# EAGLE schematic CDCEmu_Logic (EAGLE 9.6.1)
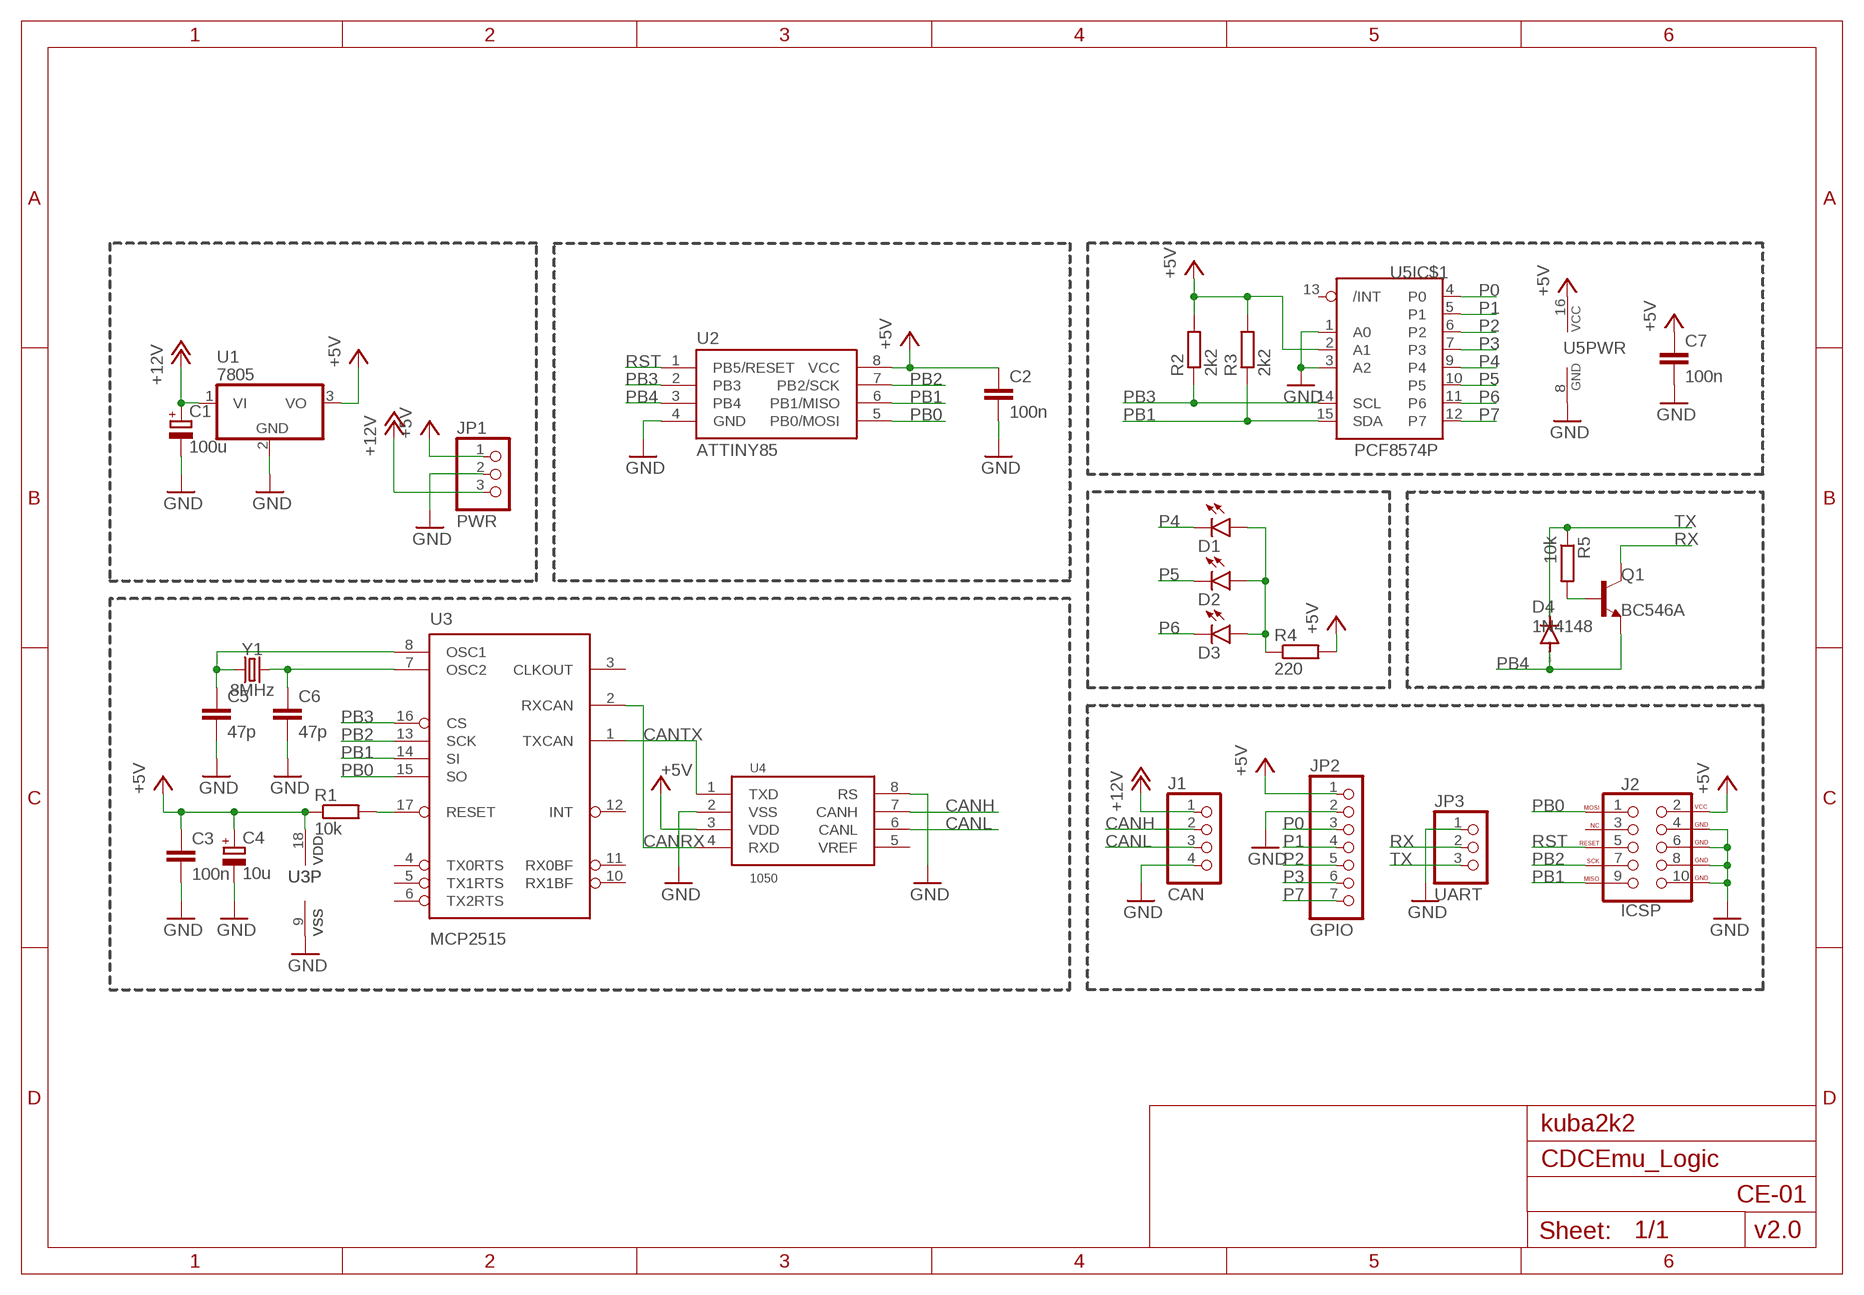
[diagram p0: schematic, sheet 1]

## Parts
C1  100u  CPOL-EUE2.5-6  [E2,5-6]
C2  100n  C-EU050-024X044  [C050-024X044]
C3  100n  C-EU050-024X044  [C050-024X044]
C4  10u  CPOL-EUE1.8-4  [E1,8-4]
C5  47p  C-EU025-024X044  [C025-024X044]
C6  47p  C-EU025-024X044  [C025-024X044]
C7  100n  C-EU050-024X044  [C050-024X044]
D1  LED3MM  [LED3MM]
D2  LED3MM  [LED3MM]
D3  LED3MM  [LED3MM]
D4  1N4148  1N4148DO35-7  [DO35-7]
J1  CAN  PINHD-1X4  [1X04]
J2  ICSP  AVR_SPI_PROG_5X2LOCK  [2X5-SHROUDED_LOCK]
JP1  PWR  PINHD-1X3  [1X03]
JP2  GPIO  PINHD-1X7  [1X07]
JP3  UART  PINHD-1X3  [1X03]
Q1  BC546A  [TO92-EBC]
R1  10k  R-EU_0204/5  [0204/5]
R2  2k2  R-EU_0204/7  [0204/7]
R3  2k2  R-EU_0204/7  [0204/7]
R4  220  R-EU_0204/7  [0204/7]
R5  10k  R-EU_0204/7  [0204/7]
U1  7805  7805TV  [TO220V]
U2  ATTINY85  ATTINY85-P  [PDIP08_300MIL]
U3  MCP2515  MCP2515(MCP2510)SO  [SO18W]
U4  1050  TJA1050  [SO08]
U5  PCF8574P  [DIL16]
Y1  8MHz  CRYSTALPTH-HC49UV  [HC49U]

## Nets
+5V: C2.1 C3.1 C4.+ C7.1 J2.2(VCC) JP1.1 JP2.1 R1.1 R2.2 R3.2 R4.2 U1.3(VO) U2.8(VCC) U3.18(VDD) U4.3(VDD) U5.2(IC$1:A1) U5.16(PWR:VCC)
+12V: C1.+ J1.1 JP1.3 U1.1(VI)
CANH: J1.2 U4.7(CANH)
CANL: J1.3 U4.6(CANL)
CANOSC1: C5.1 U3.8(OSC1) Y1.1
CANOSC2: C6.1 U3.7(OSC2) Y1.2
CANRST: R1.2 U3.17(RESET)
CANRX: U3.2(RXCAN) U4.4(RXD)
CANTX: U3.1(TXCAN) U4.1(TXD)
GND: C1.- C2.2 C3.2 C4.- C5.2 C6.2 C7.2 J1.4 J2.4(GND) J2.6(GND) J2.8(GND) J2.10(GND) JP1.2 JP2.2 JP3.1 U1.2(GND) U2.4(GND) U3.9(VSS) U4.2(VSS) U4.8(RS) U5.1(IC$1:A0) U5.3(IC$1:A2) U5.8(PWR:GND)
LED_A: D1.A D2.A D3.A R4.1
P0: JP2.3 U5.4(IC$1:P0)
P1: JP2.4 U5.5(IC$1:P1)
P2: JP2.5 U5.6(IC$1:P2)
P3: JP2.6 U5.7(IC$1:P3)
P4: D1.K(C) U5.9(IC$1:P4)
P5: D2.K(C) U5.10(IC$1:P5)
P6: D3.K(C) U5.11(IC$1:P6)
P7: JP2.7 U5.12(IC$1:P7)
PB0: J2.1(MOSI) U2.5(PB0/MOSI) U3.15(SO)
PB1: J2.9(MISO) R3.1 U2.6(PB1/MISO) U3.14(SI) U5.15(IC$1:SDA)
PB2: J2.7(SCK) U2.7(PB2/SCK) U3.13(SCK)
PB3: R2.1 U2.2(PB3) U3.16(CS) U5.14(IC$1:SCL)
PB4: D4.A Q1.E U2.3(PB4)
RST: J2.5(RESET) U2.1(PB5/RESET)
RX: JP3.2 Q1.C
TX: D4.C JP3.3 R5.1
TXB: Q1.B R5.2
Unconnected: J2.3(NC) U3.3(CLKOUT) U3.4(TX0RTS) U3.5(TX1RTS) U3.6(TX2RTS) U3.10(RX1BF) U3.11(RX0BF) U3.12(INT) U4.5(VREF) U5.13(IC$1:/INT)

## Notes on the sheet
- kuba2k2
- CE-01
- v2.0

## Library data of the parts
C1 C4 = rcl:CPOL-EU: POLARIZED CAPACITOR, European symbol; SPICEPREFIX: C
C2 C3 C5-C7 = rcl:C-EU: CAPACITOR, European symbol; SPICEPREFIX: C
D1-D3 = led:LED: LED OSRAM: - CHIPLED LG R971, LG N971, LY N971, LG Q971, LY Q971, LO R971, LY R971 LH N974, LH R974 LS Q976, LO Q976, LY Q976 LO Q996 - Hyper CHIPLED LW Q18S LB Q993, LB Q99A, LB R99A - SideLED LS A670, LO A670, LY A670, LG A670, LP A670 LB A673, LV A673, LT A673, LW A673 LH A674 LY A675 LS A676, LA A676, LO A676, LY A676, LW A676 LS A679, LY A679, LG A679 - Hyper Micro SIDELED® LS Y876, LA Y876, LO Y876, LY Y876 LT Y87S - SmartLED LW L88C, LW L88S LB L89C, LB L89S, LG L890 LS L89K, LO L89K, LY L89K LS L896, LA L896, LO L896, LY L896 - TOPLED LS T670, LO T670, LY T670, LG T670, LP T670 LSG T670, LSP T670, LSY T670, LOP T670, LYG T670 LG T671, LOG T671, LSG T671 LB T673, LV T673, LT T673, LW T673 LH T674 LS T676, LA T676, LO T676, LY T676, LB T676, LH T676, LSB T676, LW T676 LB T67C, LV T67C, LT T67C, LS T67K, LO T67K, LY T67K, LW E67C LS E67B, LA E67B, LO E67B, LY E67B, LB E67C, LV E67C, LT E67C LW T67C LS T679, LY T679, LG T679 LS T770, LO T770, LY T770, LG T770, LP T770 LB T773, LV T773, LT T773, LW T773 LH T774 LS E675, LA E675, LY E675, LS T675 LS T776, LA T776, LO T776, LY T776, LB T776 LHGB T686 LT T68C, LB T68C - Hyper Mini TOPLED® LB M676 - Mini TOPLED Santana® LG M470 LS M47K, LO M47K, LY M47K Source: http://www.osram.convergy.de LUXEON: - LUMILED® LXK2-PW12-R00, LXK2-PW12-S00, LXK2-PW14-U00, LXK2-PW14-V00 LXK2-PM12-R00, LXK2-PM12-S00, LXK2-PM14-U00 LXK2-PE12-Q00, LXK2-PE12-R00, LXK2-PE12-S00, LXK2-PE14-T00, LXK2-PE14-U00 LXK2-PB12-K00, LXK2-PB12-L00, LXK2-PB12-M00, LXK2-PB14-N00, LXK2-PB14-P00, LXK2-PB14-Q00 LXK2-PR12-L00, LXK2-PR12-M00, LXK2-PR14-Q00, LXK2-PR14-R00 LXK2-PD12-Q00, LXK2-PD12-R00, LXK2-PD12-S00 LXK2-PH12-R00, LXK2-PH12-S00 LXK2-PL12-P00, LXK2-PL12-Q00, LXK2-PL12-R00 Source: www.luxeon.com KINGBRIGHT: KA-3528ASYC Source: www.kingbright.com
D4 = diode:1N4148: DIODE high speed (Philips)
J1 = pinhead:PINHD-1X4: PIN HEADER
J2 = SparkFun-Connectors:AVR_SPI_PROG_5X2: AVR 10-pin ICSP Header This is the standard AVR In Circuit Serial Programming header. Minimal, but includes pin one indicator. Works with standard Olimex programmers. SparkFun Products: 2x5 AVR ICSP Male Header <https://www.sparkfun.com/products/778> - PTH 2x5 Pin Shrouded Header <https://www.sparkfun.com/products/8506> - PTH2; PROD_ID: CONN-08671; SF_ID: PRT-08506
JP1 JP3 = pinhead:PINHD-1X3: PIN HEADER
JP2 = pinhead:PINHD-1X7: PIN HEADER
Q1 = transistor-npn:BC546*: NPN Transistor
R1-R5 = rcl:R-EU_: RESISTOR, European symbol; SPICEPREFIX: R
U1 = linear:78*: Positive VOLTAGE REGULATOR Source: http://cache.national.com/ds/LM/LM78L05.pdf http://www.fairchildsemi.com/ds/LM/LM7805.pdf
U2 = attinyx5:ATTINY85*: ATMEL ATtiny 85 Packages: P = PDIP 08 30mil S = SOIC 08 EIAJ 208mil Technologies Note: for complete ordering code (temp. range, finish, tape&reel etc.) see www.atmel.com • Supply Voltage: V = (1.8…5.5)V | [blank] = (2.7…5.5)V • Speed: 10 = 10 MHz | 20 = 20 MHz Author: Dipl.-Ing. FH Rainer Bayer HHN Hochschule Heilbronn (Heilbronn University), rainer.bayer@hs-heilbronn.de Ingenieurbüro ing-rb, mail@ing-rb.de
U3 = SparkFun-IC-Comms:MCP2515(MCP2510): CAN controller with SPI interface The MCP2515 controller supercedes the MCP2510 while addressing all errata associated with it. The two devices are pin compatible, either can be used with this device. 18-pin package SOIC Simple SPI interface to any MCU. One-shot mode ensures message transmission is attempted only once Databyte filtering Start-of-Frame (SOF) output Low-power CMOS Technology Datasheet <http://www.sparkfun.com/datasheets/DevTools/Arduino/MCP2515.pdf> SparkFun Products CAN-BUS Shield <https://www.sparkfun.com/products/13262> (DEV-13262); PROD_ID: IC-09906
U4 = can_driver:TJA1050: High speed CAN transceiver Input levels compatible with 3.3 V and 5 V devices 5V supply
U5 = i2c:PCF8574: Remote 8-Bit I/O Expander for I²C Bus
Y1 = SparkFun-Clocks:CRYSTAL: Crystals (Generic) These are passive quartz crystals, which can be used as a clock source for a microcontroller. Crystal's are two-terminal devices. They require external "load" capacitors to generate an oscillating signal.